# Altium schematic sheet 1.SchDoc: Блок сбора данных
size 420 x 297 mm; CheckedBy: Рязанцев; Author: Устинова; SheetNumber: 1; SheetTotal: 1
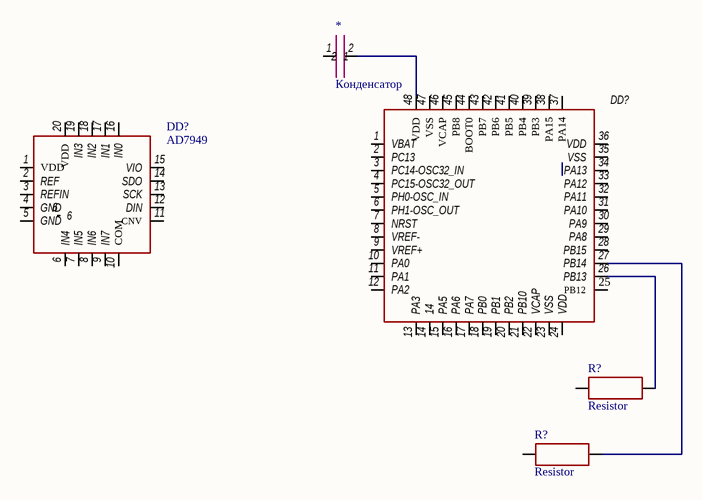
[diagram p0: 1.SchDoc]

## Parts
(Parts that share a designator on the sheet are numbered #1, #2 ... from top to bottom, then left to right.)
*  Конденсатор  [Конденсатор]
DD?#1  STM32H503CB  [CQFP50P1170X1170X160-48N]  (value not drawn)
DD?#2  AD7949
R?#1  Resistor  [R_0603]
R?#2  Resistor  [R_0603]

## Nets
Net*_2: *.2 DD?#1.48(VDD)
NetDD?#1_26: DD?#1.26(PB13) R?#1.2
NetDD?#1_27: DD?#1.27(PB14) R?#2.2

Not connected (* = marked no-connect by the designer): * 1; DD?#1 1(VBAT) 2(PC13) 3(PC14-OSC32_IN) 4(PC15-OSC32_OUT) 5(PH0-OSC_IN) 6(PH1-OSC_OUT) 7(NRST) 8(VREF-) 9(VREF+) 10(PA0) 11(PA1) 12(PA2) 13(PA3) 14 15(PA5) 16(PA6) 17(PA7) 18(PB0) 19(PB1) 20(PB2) 21(PB10) 22(VCAP) 23(VSS) 24(VDD) 25(PB12) 28(PB15) 29(PA8) 30(PA9) 31(PA10) 32(PA11) 33(PA12) 34(PA13) 35(VSS) 36(VDD) 37(PA14) 38(PA15) 39(PB3) 40(PB4) 41(PB5) 42(PB6) 43(PB7) 44(BOOT0) 45(PB8) 46(VCAP) 47(VSS); DD?#2 1(VDD) 2(REF) 3(REFIN) 4(GND) 5(GND) 6 7(IN5) 8(IN6) 9(IN7) 10(COM) 11(CNV) 12(DIN) 13(SCK) 14(SDO) 15(VIO) 16(IN0) 17(IN1) 18(IN2) 19(IN3) 20(VDD); R?#1 1; R?#2 1

## Notes on the sheet
- Перв.примен.
- Справ.№
- Подп. и дата
- Инв.№ дубл.
- Взам.инв.№
- Подп.и дата
- Разраб.
- Изм.
- Лист
- № докум.
- Подп.
- Дата
- Лит.
- Масштаб
- Масса
- Т.контр.
- Пров.
- СХЕМА   ЭЛЕКТРИЧЕСКАЯ
- ПРИНЦИПИАЛЬНАЯ
- Листов
- Инв.№ подл.
- Утв.
- Н.контр.
- Нач.сект.
- Формат  A3